# Altium schematic sheet can-1.SchDoc
size A0
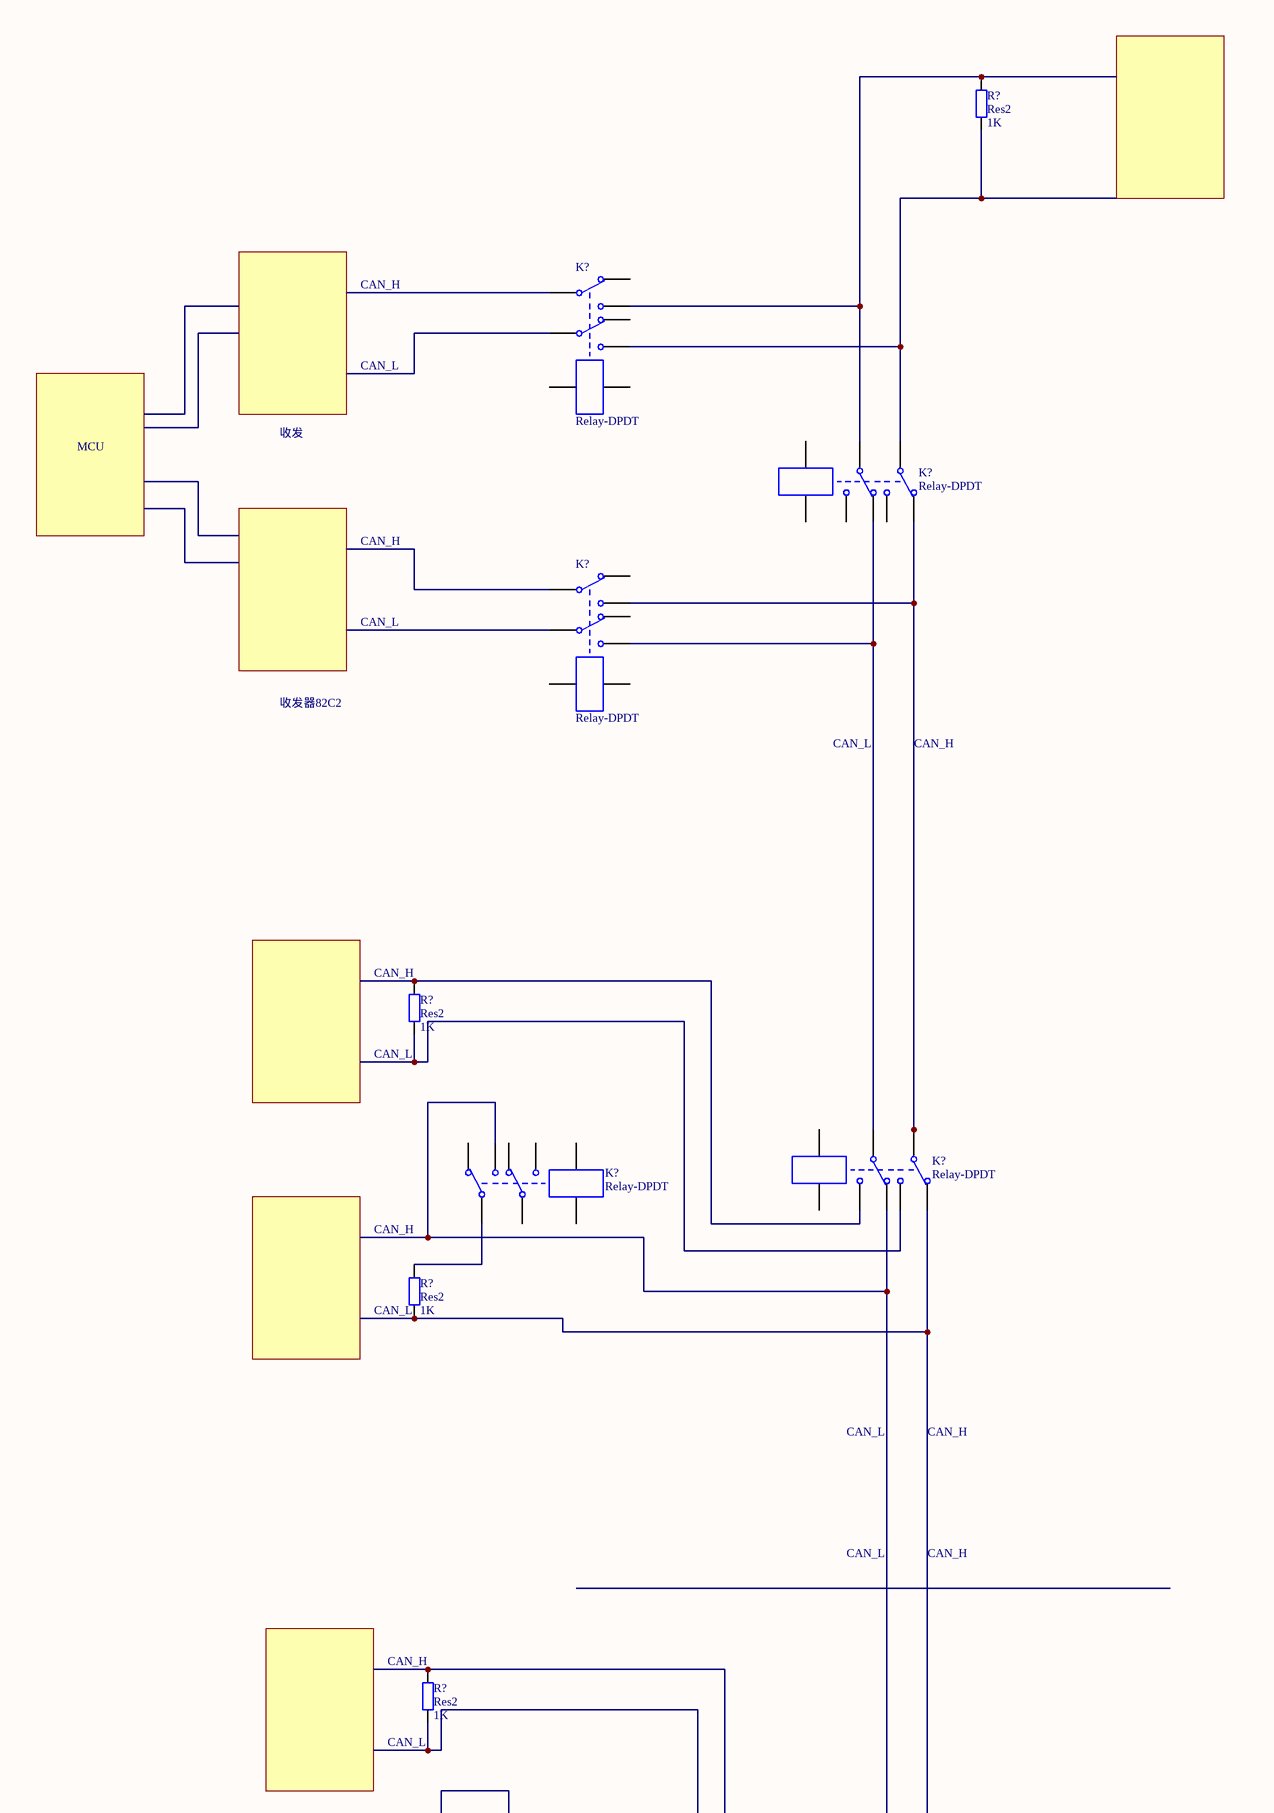
[diagram p0: can-1.SchDoc, top]
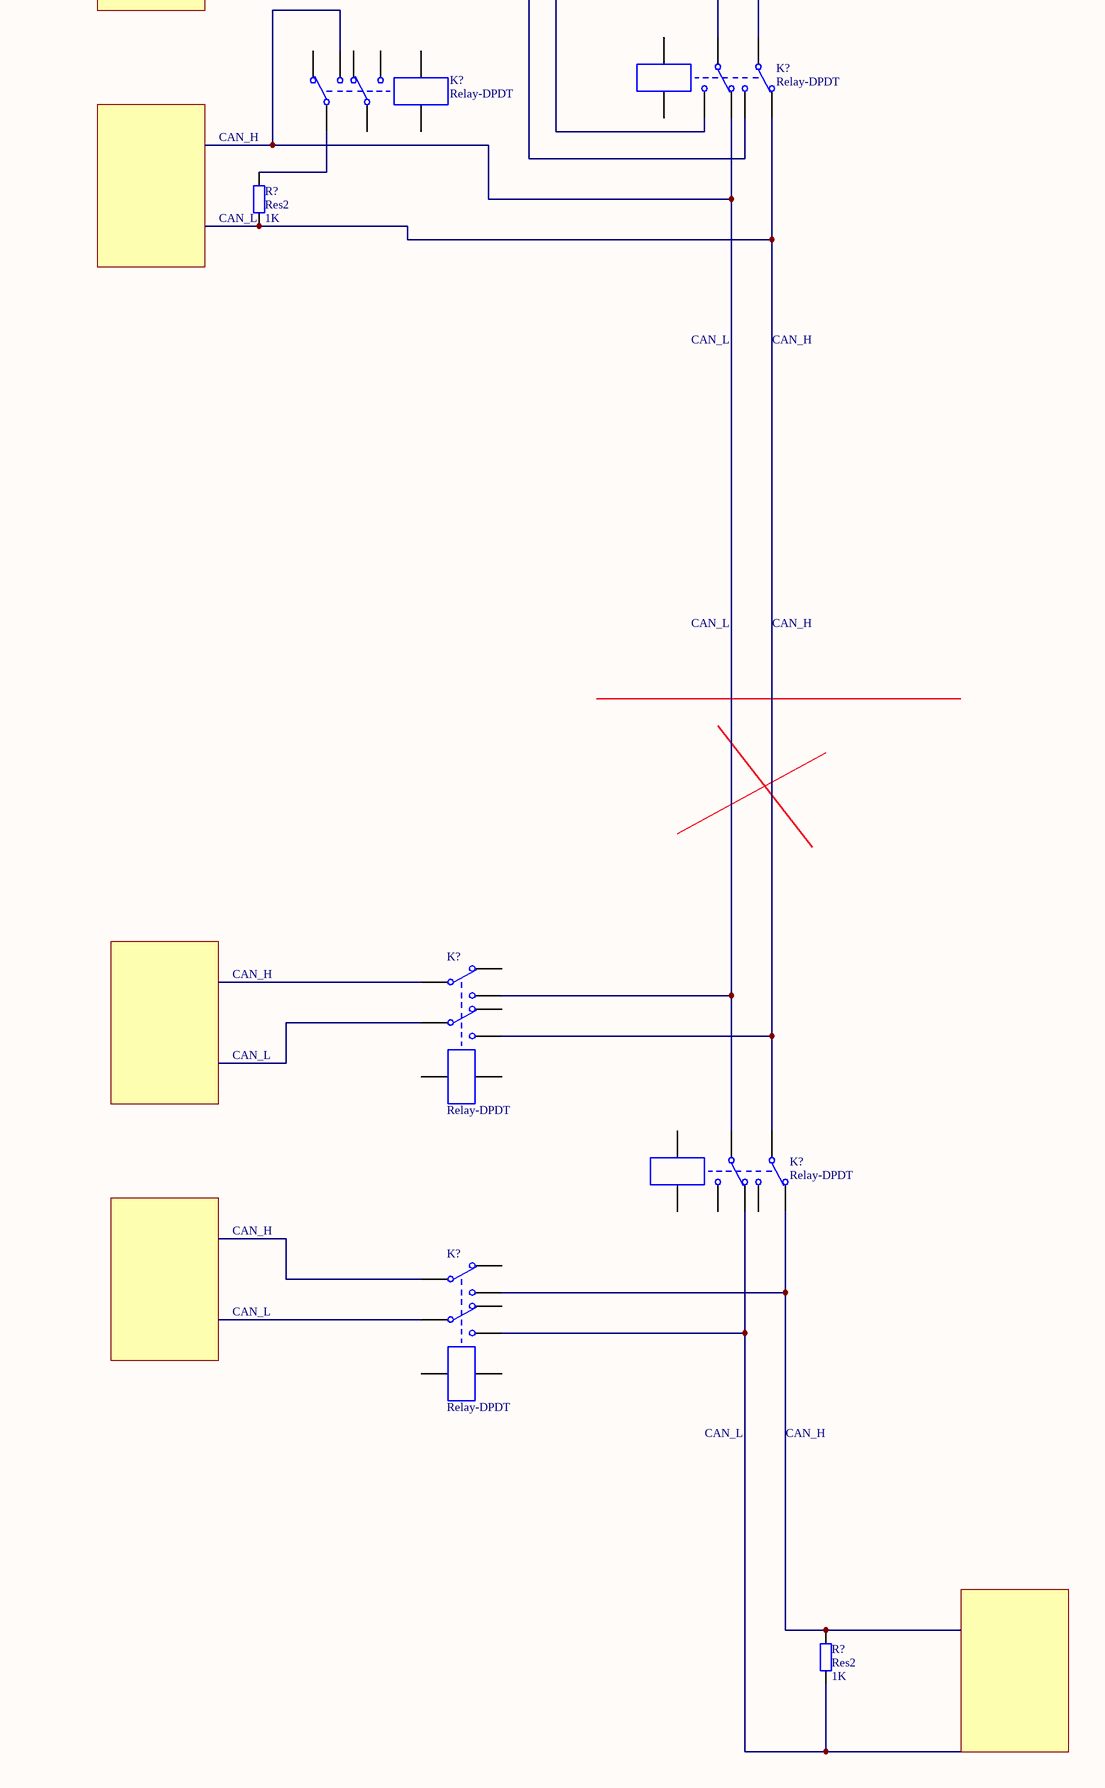
[diagram p1: can-1.SchDoc, bottom]

## Parts
(Parts that share a designator on the sheet are numbered #1, #2 ... from top to bottom, then left to right.)
K?#1  Relay-DPDT  [DIP-P8]
K?#2  Relay-DPDT  [DIP-P8]
K?#3  Relay-DPDT  [DIP-P8]
K?#4  Relay-DPDT  [DIP-P8]
K?#5  Relay-DPDT  [DIP-P8]
K?#6  Relay-DPDT  [DIP-P8]
K?#7  Relay-DPDT  [DIP-P8]
K?#8  Relay-DPDT  [DIP-P8]
K?#9  Relay-DPDT  [DIP-P8]
K?#10  Relay-DPDT  [DIP-P8]
R?#1  Res2  value 1K  [AXIAL-0.4]
R?#2  Res2  value 1K  [AXIAL-0.4]
R?#3  Res2  value 1K  [AXIAL-0.4]
R?#4  Res2  value 1K  [AXIAL-0.4]
R?#5  Res2  value 1K  [AXIAL-0.4]
R?#6  Res2  value 1K  [AXIAL-0.4]

## Nets
NetK?#1_3: K?#1.3 K?#2.4 R?#1.2
NetK?#1_6: K?#1.6 K?#2.1 R?#1.1
NetK?#2_2: K?#2.2 K?#3.3 K?#4.1
NetK?#2_5: K?#2.5 K?#3.6 K?#4.4
NetK?#4_2: K?#4.2 K?#6.1 R?#3.1
NetK?#4_3: K?#4.3 R?#2.1
NetK?#4_5: K?#4.5 K?#5.3 K?#6.4
NetK?#4_6: K?#4.6 R?#2.2
NetK?#5_1: K?#5.1 R?#3.2
NetK?#6_2: K?#6.2 K?#8.6 K?#9.1 R?#5.1
NetK?#6_3: K?#6.3 R?#4.1
NetK?#6_5: K?#6.5 K?#7.3 K?#8.3 K?#9.4
NetK?#6_6: K?#6.6 R?#4.2
NetK?#7_1: K?#7.1 R?#5.2
NetK?#9_2: K?#9.2 K?#10.3 R?#6.2
NetK?#9_5: K?#9.5 K?#10.6 R?#6.1

Not connected (* = marked no-connect by the designer): K?#1 1 2 4 5 7 8; K?#2 3 6 7 8; K?#3 1 2 4 5 7 8; K?#4 7 8; K?#5 2 4 5 6 7 8; K?#6 7 8; K?#7 2 4 5 6 7 8; K?#8 1 2 4 5 7 8; K?#9 3 6 7 8; K?#10 1 2 4 5 7 8

## Notes on the sheet
- CAN_H
- CAN_L
- MCU
- 收发
- 收发器82C2
- (near R?#2) CAN_H
- (near R?#2) CAN_L
- (near R?#3) CAN_H
- (near R?#3) CAN_L
- (near R?#4) CAN_H
- (near R?#4) CAN_L
- (near R?#5) CAN_H
- (near R?#5) CAN_L

## Library data of the parts
K?#1-K?#10 = Relay-DPDT: Dual-Pole Dual-Throw Relay; Published: 24-Mar-1999; LatestRevisionDate: 17-Jul-2002; LatestRevisionNote: Re-released for DXP Platform.; PackageReference: DIP-P8; Publisher: Altium Limited; PackageDescription: Relay; 8 Leads
R?#1-R?#6 = Res2: Resistor; Published: 8-Jun-2000; LatestRevisionDate: 17-Jul-2002; LatestRevisionNote: Re-released for DXP Platform.; PackageReference: AXIAL-0.4; Publisher: Altium Limited; PackageDescription: Axial Device, Thru-Hole; 2 Leads; 0.4 in Pin Spacing